# EAGLE design Mainboard_v1 (EAGLE 6.3)
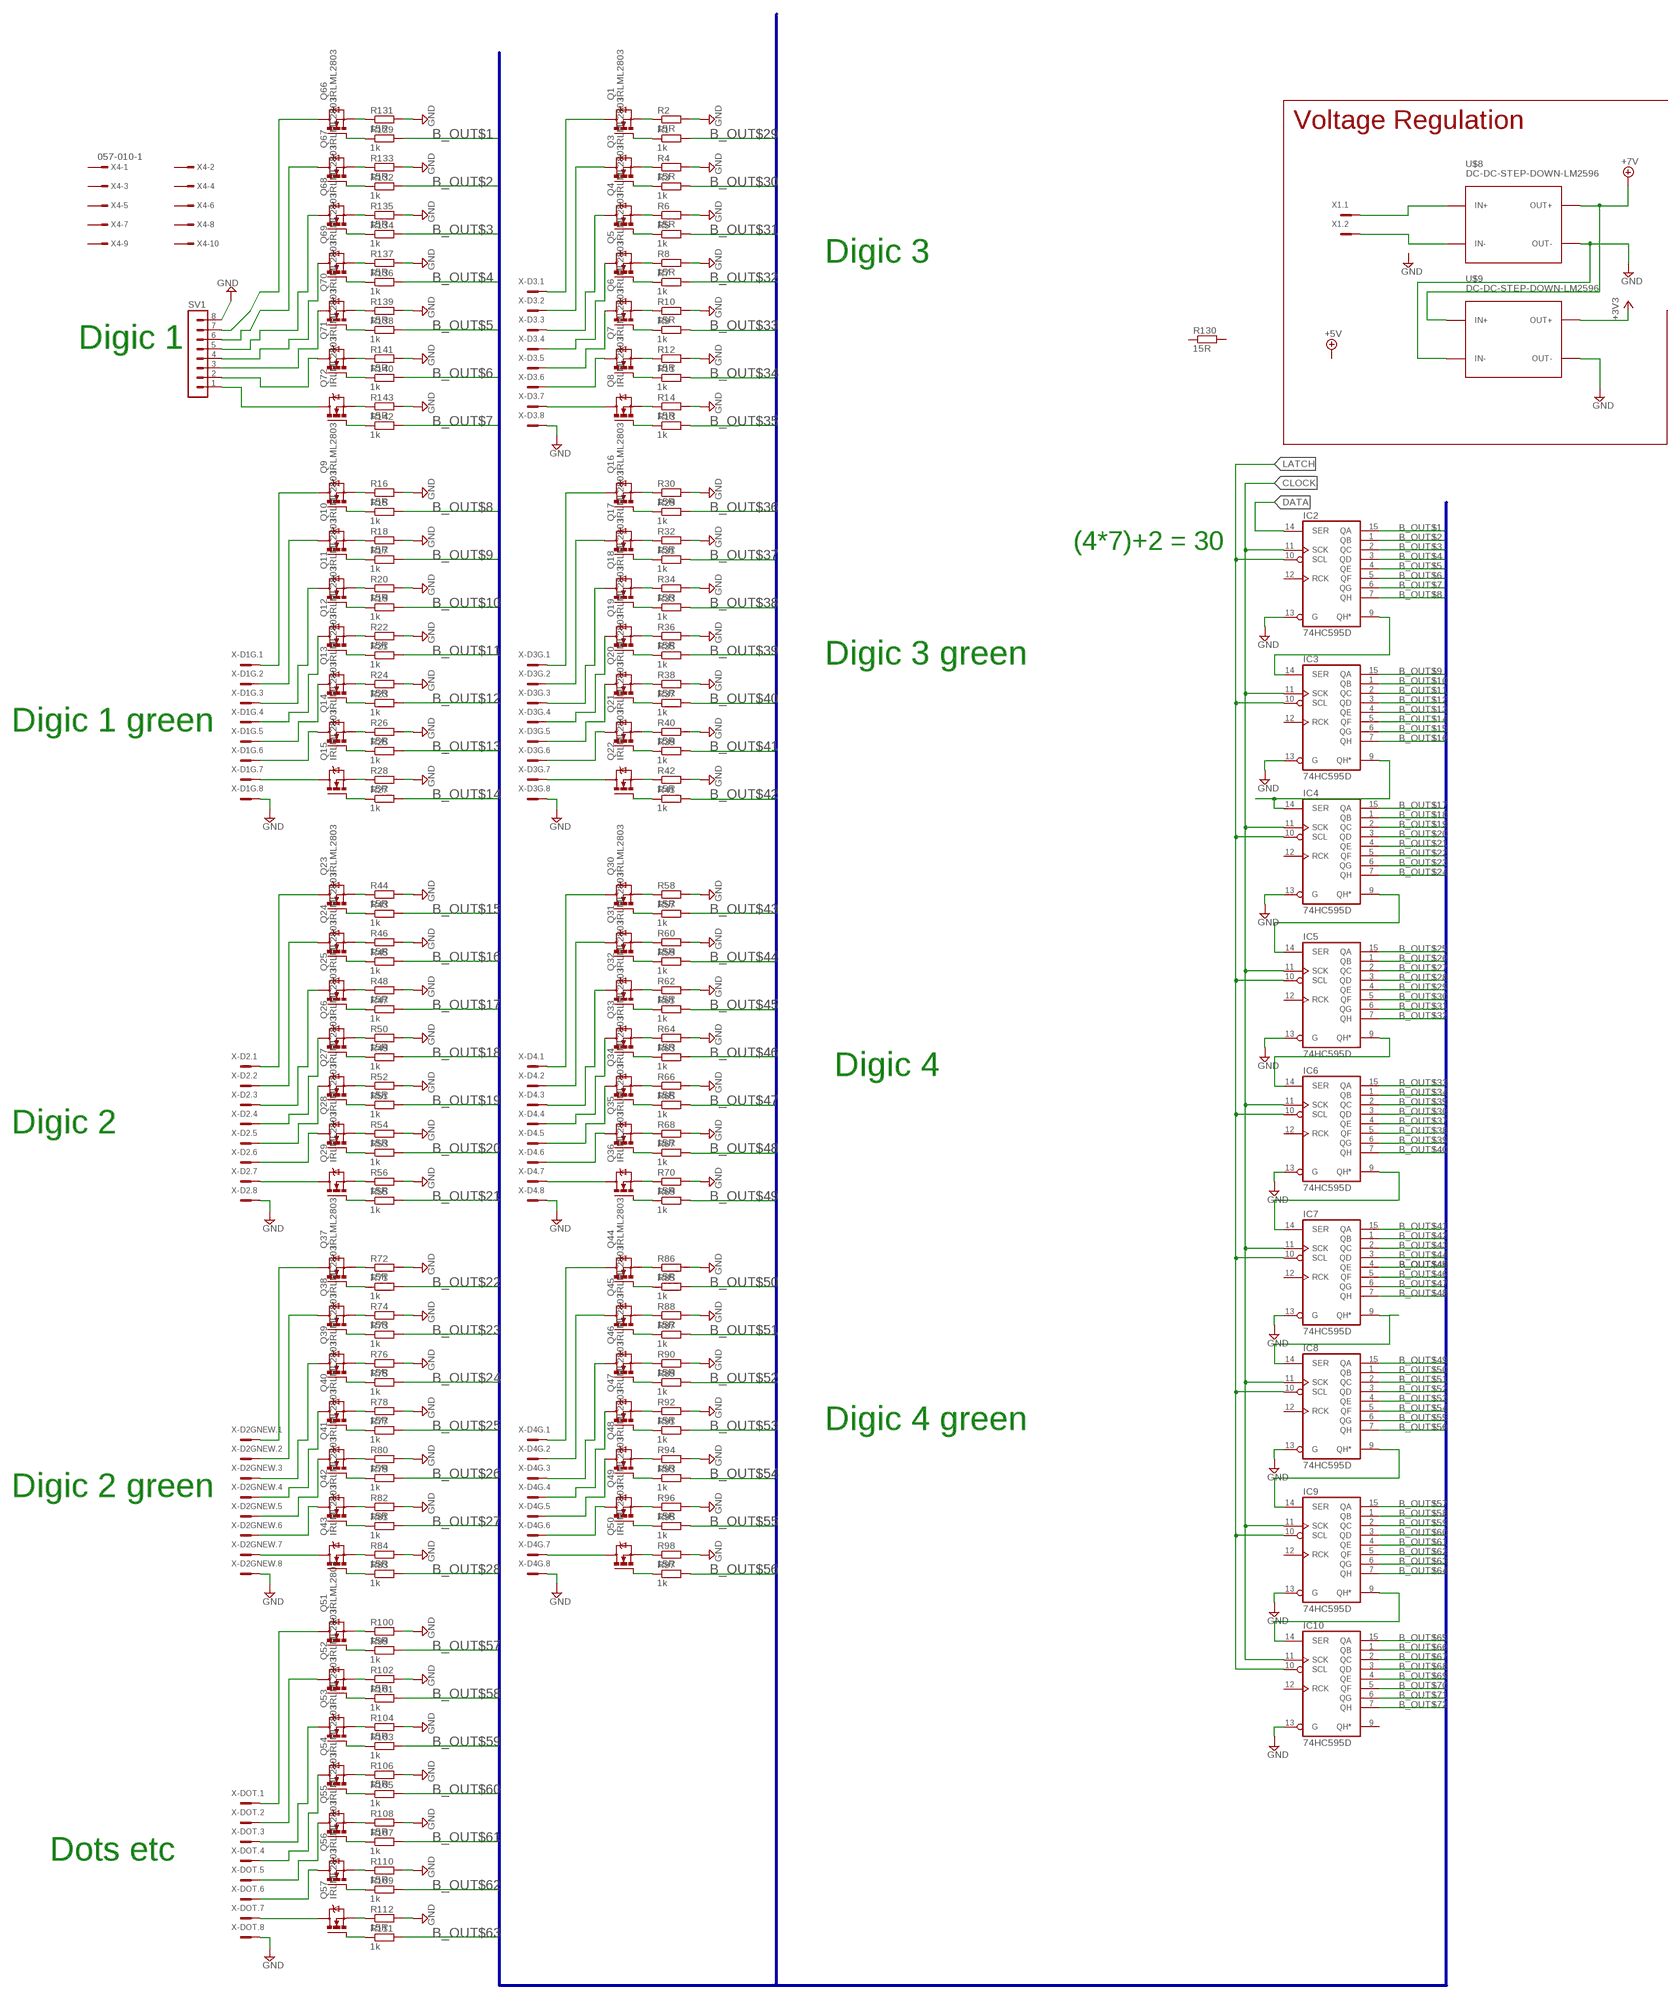
[diagram p0: schematic, sheet 1, part 1 of 2]
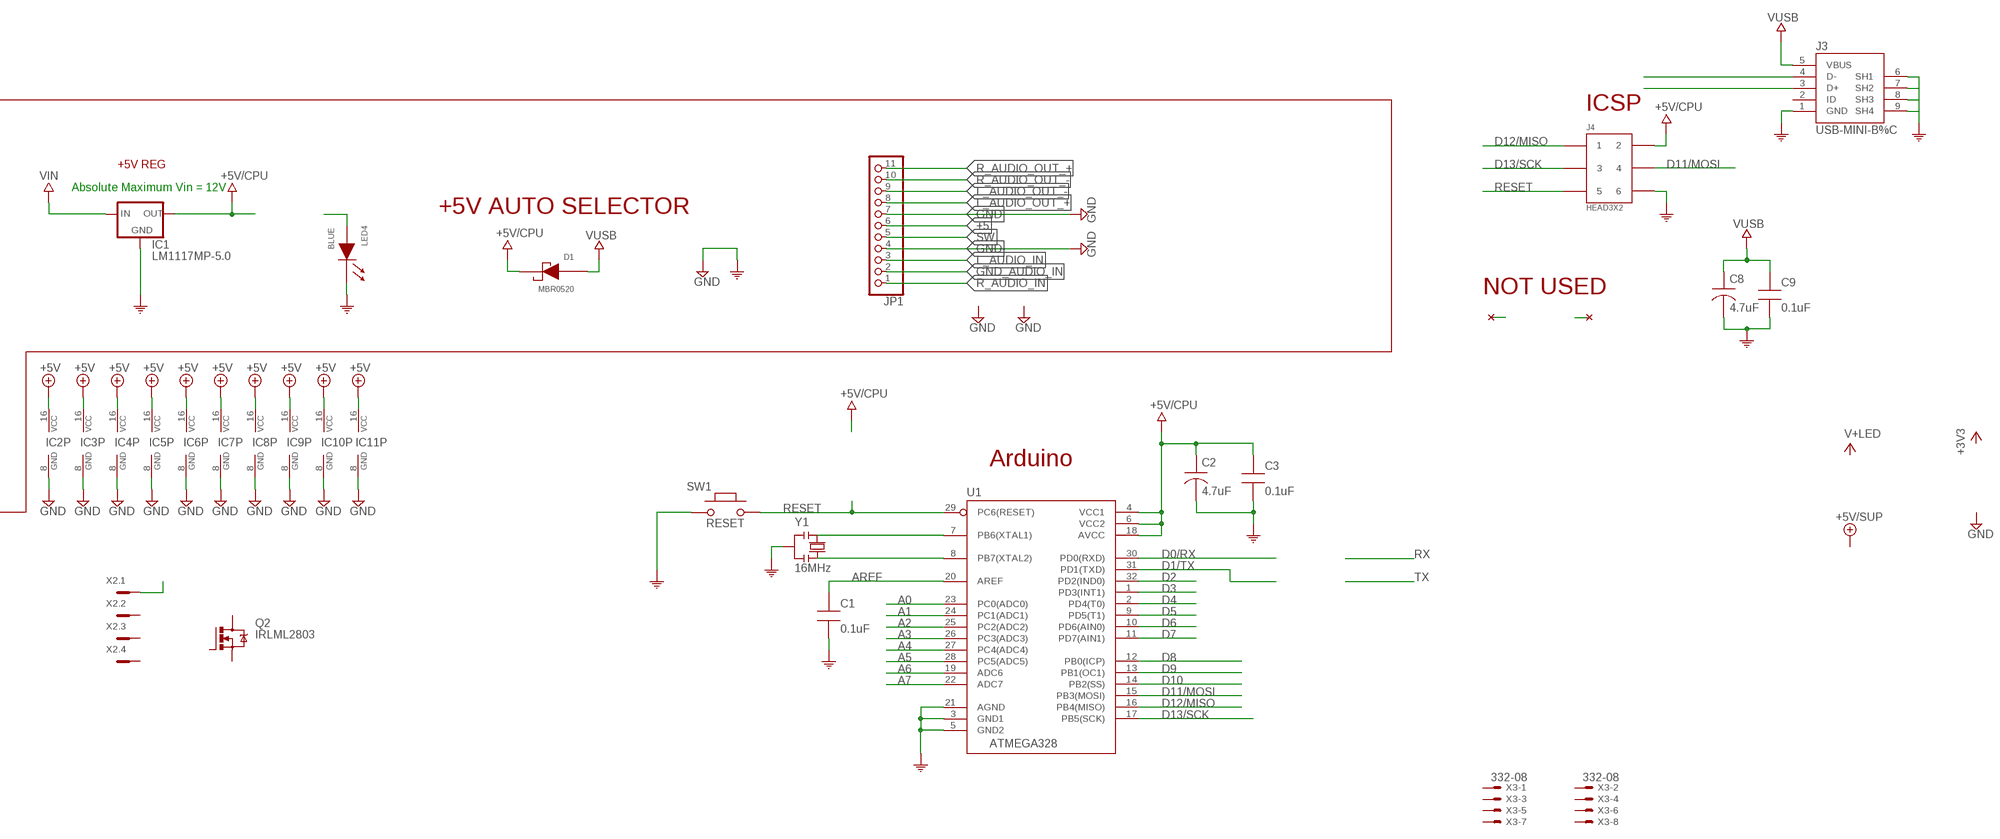
[diagram p1: schematic, sheet 1, part 2 of 2]

## Parts
C1  0.1uF  CAP0805-NP  [CAP0805-NP]
C2  4.7uF  CAP-TANA-P  [TAN-A]
C3  0.1uF  CAP0805-NP  [CAP0805-NP]
C8  4.7uF  CAP-TANA-P  [TAN-A]
C9  0.1uF  CAP0805-NP  [CAP0805-NP]
D1  MBR0520  [SOD-123]
IC1  LM1117MP-5.0  [SOT223]
IC2  74HC595D  [SO16]
IC3  74HC595D  [SO16]
IC4  74HC595D  [SO16]
IC5  74HC595D  [SO16]
IC6  74HC595D  [SO16]
IC7  74HC595D  [SO16]
IC8  74HC595D  [SO16]
IC9  74HC595D  [SO16]
IC10  74HC595D  [SO16]
IC11  74HC595D  [SO16]
J3  USB-MINI-B%C  [USB-MINI-B_2]
J4  HEAD3X2  [HEAD3X2]
JP1  PINHD-1X11_2.00  [1X11M]
LED4  BLUE  LED0805  [LED0805]
Q1  IRLML2803  [MICRO3]
Q2  IRLML2803  [MICRO3]
Q3  IRLML2803  [MICRO3]
Q4  IRLML2803  [MICRO3]
Q5  IRLML2803  [MICRO3]
Q6  IRLML2803  [MICRO3]
Q7  IRLML2803  [MICRO3]
Q8  IRLML2803  [MICRO3]
Q9  IRLML2803  [MICRO3]
Q10  IRLML2803  [MICRO3]
Q11  IRLML2803  [MICRO3]
Q12  IRLML2803  [MICRO3]
Q13  IRLML2803  [MICRO3]
Q14  IRLML2803  [MICRO3]
Q15  IRLML2803  [MICRO3]
Q16  IRLML2803  [MICRO3]
Q17  IRLML2803  [MICRO3]
Q18  IRLML2803  [MICRO3]
Q19  IRLML2803  [MICRO3]
Q20  IRLML2803  [MICRO3]
Q21  IRLML2803  [MICRO3]
Q22  IRLML2803  [MICRO3]
Q23  IRLML2803  [MICRO3]
Q24  IRLML2803  [MICRO3]
Q25  IRLML2803  [MICRO3]
Q26  IRLML2803  [MICRO3]
Q27  IRLML2803  [MICRO3]
Q28  IRLML2803  [MICRO3]
Q29  IRLML2803  [MICRO3]
Q30  IRLML2803  [MICRO3]
Q31  IRLML2803  [MICRO3]
Q32  IRLML2803  [MICRO3]
Q33  IRLML2803  [MICRO3]
Q34  IRLML2803  [MICRO3]
Q35  IRLML2803  [MICRO3]
Q36  IRLML2803  [MICRO3]
Q37  IRLML2803  [MICRO3]
Q38  IRLML2803  [MICRO3]
Q39  IRLML2803  [MICRO3]
Q40  IRLML2803  [MICRO3]
Q41  IRLML2803  [MICRO3]
Q42  IRLML2803  [MICRO3]
Q43  IRLML2803  [MICRO3]
Q44  IRLML2803  [MICRO3]
Q45  IRLML2803  [MICRO3]
Q46  IRLML2803  [MICRO3]
Q47  IRLML2803  [MICRO3]
Q48  IRLML2803  [MICRO3]
Q49  IRLML2803  [MICRO3]
Q50  IRLML2803  [MICRO3]
Q51  IRLML2803  [MICRO3]
Q52  IRLML2803  [MICRO3]
Q53  IRLML2803  [MICRO3]
Q54  IRLML2803  [MICRO3]
Q55  IRLML2803  [MICRO3]
Q56  IRLML2803  [MICRO3]
Q57  IRLML2803  [MICRO3]
Q66  IRLML2803  [MICRO3]
Q67  IRLML2803  [MICRO3]
Q68  IRLML2803  [MICRO3]
Q69  IRLML2803  [MICRO3]
Q70  IRLML2803  [MICRO3]
Q71  IRLML2803  [MICRO3]
Q72  IRLML2803  [MICRO3]
R1  1k  R-EU_M0805  [M0805]
R2  15R  R-EU_M1206  [M1206]
R3  1k  R-EU_M0805  [M0805]
R4  15R  R-EU_M1206  [M1206]
R5  1k  R-EU_M0805  [M0805]
R6  15R  R-EU_M1206  [M1206]
R7  1k  R-EU_M0805  [M0805]
R8  15R  R-EU_M1206  [M1206]
R9  1k  R-EU_M0805  [M0805]
R10  15R  R-EU_M1206  [M1206]
R11  1k  R-EU_M0805  [M0805]
R12  15R  R-EU_M1206  [M1206]
R13  1k  R-EU_M0805  [M0805]
R14  15R  R-EU_M1206  [M1206]
R15  1k  R-EU_M0805  [M0805]
R16  15R  R-EU_M1206  [M1206]
R17  1k  R-EU_M0805  [M0805]
R18  15R  R-EU_M1206  [M1206]
R19  1k  R-EU_M0805  [M0805]
R20  15R  R-EU_M1206  [M1206]
R21  1k  R-EU_M0805  [M0805]
R22  15R  R-EU_M1206  [M1206]
R23  1k  R-EU_M0805  [M0805]
R24  15R  R-EU_M1206  [M1206]
R25  1k  R-EU_M0805  [M0805]
R26  15R  R-EU_M1206  [M1206]
R27  1k  R-EU_M0805  [M0805]
R28  15R  R-EU_M1206  [M1206]
R29  1k  R-EU_M0805  [M0805]
R30  15R  R-EU_M1206  [M1206]
R31  1k  R-EU_M0805  [M0805]
R32  15R  R-EU_M1206  [M1206]
R33  1k  R-EU_M0805  [M0805]
R34  15R  R-EU_M1206  [M1206]
R35  1k  R-EU_M0805  [M0805]
R36  15R  R-EU_M1206  [M1206]
R37  1k  R-EU_M0805  [M0805]
R38  15R  R-EU_M1206  [M1206]
R39  1k  R-EU_M0805  [M0805]
R40  15R  R-EU_M1206  [M1206]
R41  1k  R-EU_M0805  [M0805]
R42  15R  R-EU_M1206  [M1206]
R43  1k  R-EU_M0805  [M0805]
R44  15R  R-EU_M1206  [M1206]
R45  1k  R-EU_M0805  [M0805]
R46  15R  R-EU_M1206  [M1206]
R47  1k  R-EU_M0805  [M0805]
R48  15R  R-EU_M1206  [M1206]
R49  1k  R-EU_M0805  [M0805]
R50  15R  R-EU_M1206  [M1206]
R51  1k  R-EU_M0805  [M0805]
R52  15R  R-EU_M1206  [M1206]
R53  1k  R-EU_M0805  [M0805]
R54  15R  R-EU_M1206  [M1206]
R55  1k  R-EU_M0805  [M0805]
R56  15R  R-EU_M1206  [M1206]
R57  1k  R-EU_M0805  [M0805]
R58  15R  R-EU_M1206  [M1206]
R59  1k  R-EU_M0805  [M0805]
R60  15R  R-EU_M1206  [M1206]
R61  1k  R-EU_M0805  [M0805]
R62  15R  R-EU_M1206  [M1206]
R63  1k  R-EU_M0805  [M0805]
R64  15R  R-EU_M1206  [M1206]
R65  1k  R-EU_M0805  [M0805]
R66  15R  R-EU_M1206  [M1206]
R67  1k  R-EU_M0805  [M0805]
R68  15R  R-EU_M1206  [M1206]
R69  1k  R-EU_M0805  [M0805]
R70  15R  R-EU_M1206  [M1206]
R71  1k  R-EU_M0805  [M0805]
R72  15R  R-EU_M1206  [M1206]
R73  1k  R-EU_M0805  [M0805]
R74  15R  R-EU_M1206  [M1206]
R75  1k  R-EU_M0805  [M0805]
R76  15R  R-EU_M1206  [M1206]
R77  1k  R-EU_M0805  [M0805]
R78  15R  R-EU_M1206  [M1206]
R79  1k  R-EU_M0805  [M0805]
R80  15R  R-EU_M1206  [M1206]
R81  1k  R-EU_M0805  [M0805]
R82  15R  R-EU_M1206  [M1206]
R83  1k  R-EU_M0805  [M0805]
R84  15R  R-EU_M1206  [M1206]
R85  1k  R-EU_M0805  [M0805]
R86  15R  R-EU_M1206  [M1206]
R87  1k  R-EU_M0805  [M0805]
R88  15R  R-EU_M1206  [M1206]
R89  1k  R-EU_M0805  [M0805]
R90  15R  R-EU_M1206  [M1206]
R91  1k  R-EU_M0805  [M0805]
R92  15R  R-EU_M1206  [M1206]
R93  1k  R-EU_M0805  [M0805]
R94  15R  R-EU_M1206  [M1206]
R95  1k  R-EU_M0805  [M0805]
R96  15R  R-EU_M1206  [M1206]
R97  1k  R-EU_M0805  [M0805]
R98  15R  R-EU_M1206  [M1206]
R99  1k  R-EU_M0805  [M0805]
R100  15R  R-EU_M1206  [M1206]
R101  1k  R-EU_M0805  [M0805]
R102  15R  R-EU_M1206  [M1206]
R103  1k  R-EU_M0805  [M0805]
R104  15R  R-EU_M1206  [M1206]
R105  1k  R-EU_M0805  [M0805]
R106  15R  R-EU_M1206  [M1206]
R107  1k  R-EU_M0805  [M0805]
R108  15R  R-EU_M1206  [M1206]
R109  1k  R-EU_M0805  [M0805]
R110  15R  R-EU_M1206  [M1206]
R111  1k  R-EU_M0805  [M0805]
R112  15R  R-EU_M1206  [M1206]
R129  1k  R-EU_M0805  [M0805]
R130  15R  R-EU_M1206  [M1206]
R131  15R  R-EU_M1206  [M1206]
R132  1k  R-EU_M0805  [M0805]
R133  15R  R-EU_M1206  [M1206]
R134  1k  R-EU_M0805  [M0805]
R135  15R  R-EU_M1206  [M1206]
R136  1k  R-EU_M0805  [M0805]
R137  15R  R-EU_M1206  [M1206]
R138  1k  R-EU_M0805  [M0805]
R139  15R  R-EU_M1206  [M1206]
R140  1k  R-EU_M0805  [M0805]
R141  15R  R-EU_M1206  [M1206]
R142  1k  R-EU_M0805  [M0805]
R143  15R  R-EU_M1206  [M1206]
SV1  MA08-1W  [MA08-1W]
SW1  RESET  PB157  [157SW]
U1  ATMEGA328  ATMEGA168-20AU  [QFP032]
U$8  DC-DC-STEP-DOWN-LM2596  [DC-DC-STEP-DOWN-LM2596]
U$9  DC-DC-STEP-DOWN-LM2596  [DC-DC-STEP-DOWN-LM2596]
X1  MCV2-LOCK  [MCV2-LOCK]
X2  MCV4-LOCK  [MCV4-LOCK]
X3  332-08  [332-08]
X4  057-010-1  [057-010-1]
X-D1G  MCV8-LOCK  [MCV8-LOCK]
X-D2  MCV8-LOCK  [MCV8-LOCK]
X-D2GNEW  MCV8-LOCK  [MCV8-LOCK]
X-D3  MCV8-LOCK  [MCV8-LOCK]
X-D3G  MCV8-LOCK  [MCV8-LOCK]
X-D4  MCV8-LOCK  [MCV8-LOCK]
X-D4G  MCV8-LOCK  [MCV8-LOCK]
X-DOT  MCV8-LOCK  [MCV8-LOCK]
Y1  16MHz  RESONATORMU  [RESONATOR]

## Nets
+3V3: U$9.OUT+
+5: JP1.6
+5V: C2.1 C3.1 D1.1(CA) IC1.2(OUT) IC1.4(OUT) IC2.16(VCC) IC3.16(VCC) IC4.16(VCC) IC5.16(VCC) IC6.16(VCC) IC7.16(VCC) IC8.16(VCC) IC9.16(VCC) IC10.16(VCC) IC11.16(VCC) J4.2 U1.4(VCC1) U1.6(VCC2) U1.18(AVCC) ; supply symbol labelled +5V/CPU
+7V: U$8.OUT+ U$9.IN+
A0: U1.23(PC0(ADC0))
A1: U1.24(PC1(ADC1))
A2: U1.25(PC2(ADC2))
A3: U1.26(PC3(ADC3))
A4: U1.27(PC4(ADC4))
A5: U1.28(PC5(ADC5))
A6: U1.19(ADC6)
A7: U1.22(ADC7)
AREF: C1.1 U1.20(AREF)
B_OUT$1: IC2.15(QA) R129.2
B_OUT$2: IC2.1(QB) R132.2
B_OUT$3: IC2.2(QC) R134.2
B_OUT$4: IC2.3(QD) R136.2
B_OUT$5: IC2.4(QE) R138.2
B_OUT$6: IC2.5(QF) R140.2
B_OUT$7: IC2.6(QG) R142.2
B_OUT$8: IC2.7(QH) R15.2
B_OUT$9: IC3.15(QA) R17.2
B_OUT$10: IC3.1(QB) R19.2
B_OUT$11: IC3.2(QC) R21.2
B_OUT$12: IC3.3(QD) R23.2
B_OUT$13: IC3.4(QE) R25.2
B_OUT$14: IC3.5(QF) R27.2
B_OUT$15: IC3.6(QG) R43.2
B_OUT$16: IC3.7(QH) R45.2
B_OUT$17: IC4.15(QA) R47.2
B_OUT$18: IC4.1(QB) R49.2
B_OUT$19: IC4.2(QC) R51.2
B_OUT$20: IC4.3(QD) R53.2
B_OUT$21: IC4.4(QE) R55.2
B_OUT$22: IC4.5(QF) R71.2
B_OUT$23: IC4.6(QG) R73.2
B_OUT$24: IC4.7(QH) R75.2
B_OUT$25: IC5.15(QA) R77.2
B_OUT$26: IC5.1(QB) R79.2
B_OUT$27: IC5.2(QC) R81.2
B_OUT$28: IC5.3(QD) R83.2
B_OUT$29: IC5.4(QE) R1.2
B_OUT$30: IC5.5(QF) R3.2
B_OUT$31: IC5.6(QG) R5.2
B_OUT$32: IC5.7(QH) R7.2
B_OUT$33: IC6.15(QA) R9.2
B_OUT$34: IC6.1(QB) R11.2
B_OUT$35: IC6.2(QC) R13.2
B_OUT$36: IC6.3(QD) R29.2
B_OUT$37: IC6.4(QE) R31.2
B_OUT$38: IC6.5(QF) R33.2
B_OUT$39: IC6.6(QG) R35.2
B_OUT$40: IC6.7(QH) R37.2
B_OUT$41: IC7.15(QA) R39.2
B_OUT$42: IC7.1(QB) R41.2
B_OUT$43: IC7.2(QC) R57.2
B_OUT$44: IC7.3(QD) R59.2
B_OUT$45: IC7.4(QE) R61.2
B_OUT$46: IC7.5(QF) R63.2
B_OUT$47: IC7.6(QG) R65.2
B_OUT$48: IC7.7(QH) R67.2
B_OUT$49: IC8.15(QA) R69.2
B_OUT$50: IC8.1(QB) R85.2
B_OUT$51: IC8.2(QC) R87.2
B_OUT$52: IC8.3(QD) R89.2
B_OUT$53: IC8.4(QE) R91.2
B_OUT$54: IC8.5(QF) R93.2
B_OUT$55: IC8.6(QG) R95.2
B_OUT$56: IC8.7(QH) R97.2
B_OUT$57: IC9.15(QA) R99.2
B_OUT$58: IC9.1(QB) R101.2
B_OUT$59: IC9.2(QC) R103.2
B_OUT$60: IC9.3(QD) R105.2
B_OUT$61: IC9.4(QE) R107.2
B_OUT$62: IC9.5(QF) R109.2
B_OUT$63: IC9.6(QG) R111.2
B_OUT$64: IC9.7(QH)
B_OUT$65: IC10.15(QA)
B_OUT$66: IC10.1(QB)
B_OUT$67: IC10.2(QC)
B_OUT$68: IC10.3(QD)
B_OUT$69: IC10.4(QE)
B_OUT$70: IC10.5(QF)
B_OUT$71: IC10.6(QG)
B_OUT$72: IC10.7(QH)
CLOCK: IC2.11(SCK) IC3.11(SCK) IC4.11(SCK) IC5.11(SCK) IC6.11(SCK) IC7.11(SCK) IC8.11(SCK) IC9.11(SCK) IC10.11(SCK)
COM: C1.2 C2.2 C3.2 C8.2 C9.2 IC1.1(GND) J3.1(GND) J3.6(SH1) J3.7(SH2) J3.8(SH3) J3.9(SH4) J4.6 LED4.1(CA) SW1.1 U1.3(GND1) U1.5(GND2) U1.21(AGND) Y1.2
D0/RX: U1.30(PD0(RXD))
D1/TX: U1.31(PD1(TXD))
D2: U1.32(PD2(IND0))
D3: U1.1(PD3(INT1))
D4: U1.2(PD4(T0))
D5: U1.9(PD5(T1))
D6: U1.10(PD6(AIN0))
D7: U1.11(PD7(AIN1))
D8: U1.12(PB0(ICP))
D9: U1.13(PB1(OC1))
D10: U1.14(PB2(SS))
D11/MOSI: J4.4 U1.15(PB3(MOSI))
D12/MISO: J4.1 U1.16(PB4(MISO))
D13/SCK: J4.3 U1.17(PB5(SCK))
DATA: IC2.14(SER)
GND: IC2.8(GND) IC2.13(G) IC3.8(GND) IC3.13(G) IC4.8(GND) IC4.13(G) IC5.8(GND) IC5.13(G) IC6.8(GND) IC6.13(G) IC7.8(GND) IC7.13(G) IC8.8(GND) IC8.13(G) IC9.8(GND) IC9.13(G) IC10.8(GND) IC10.13(G) IC11.8(GND) JP1.4 JP1.7 R2.2 R4.2 R6.2 R8.2 R10.2 R12.2 R14.2 R16.2 R18.2 R20.2 R22.2 R24.2 R26.2 R28.2 R30.2 R32.2 R34.2 R36.2 R38.2 R40.2 R42.2 R44.2 R46.2 R48.2 R50.2 R52.2 R54.2 R56.2 R58.2 R60.2 R62.2 R64.2 R66.2 R68.2 R70.2 R72.2 R74.2 R76.2 R78.2 R80.2 R82.2 R84.2 R86.2 R88.2 R90.2 R92.2 R94.2 R96.2 R98.2 R100.2 R102.2 R104.2 R106.2 R108.2 R110.2 R112.2 R131.2 R133.2 R135.2 R137.2 R139.2 R141.2 R143.2 SV1.8 U$8.OUT- U$9.IN- U$9.OUT- X-D1G.8 X-D2.8 X-D2GNEW.8 X-D3.8 X-D3G.8 X-D4.8 X-D4G.8 X-DOT.8 ; supply symbol labelled COM
GND_AUDIO_IN: JP1.2
L_AUDIO_IN: JP1.3
L_AUDIO_OUT_+: JP1.8
L_AUDIO_OUT_-: JP1.9
LATCH: IC2.10(SCL) IC3.10(SCL) IC4.10(SCL) IC5.10(SCL) IC6.10(SCL) IC7.10(SCL) IC8.10(SCL) IC9.10(SCL) IC10.10(SCL)
N$1: U1.8(PB7(XTAL2)) Y1.3
N$2: U1.7(PB6(XTAL1)) Y1.1
N$3: LED4.2(AN)
N$4: U$8.IN+ X1.1
N$5: J3.3(D+)
N$6: J3.4(D-)
N$7: U$8.IN- X1.2
N$8: X2.1
N$9: Q1.2(S) R2.1
N$10: Q1.1(G) R1.1
N$11: IC2.9(QH*) IC3.14(SER)
N$12: Q3.2(S) R4.1
N$13: Q3.1(G) R3.1
N$14: IC3.9(QH*) IC4.14(SER)
N$15: Q4.2(S) R6.1
N$16: Q4.1(G) R5.1
N$17: IC5.9(QH*) IC6.14(SER)
N$18: Q5.2(S) R8.1
N$19: Q5.1(G) R7.1
N$20: IC4.9(QH*) IC5.14(SER)
N$21: Q6.2(S) R10.1
N$22: Q6.1(G) R9.1
N$23: IC6.9(QH*) IC7.14(SER)
N$26: Q7.2(S) R12.1
N$27: Q7.1(G) R11.1
N$28: IC7.9(QH*) IC8.14(SER)
N$29: Q8.2(S) R14.1
N$30: Q8.1(G) R13.1
N$31: IC8.9(QH*) IC9.14(SER)
N$32: Q8.3(D) X-D3.7
N$33: Q7.3(D) X-D3.6
N$34: Q6.3(D) X-D3.5
N$35: Q5.3(D) X-D3.4
N$37: Q3.3(D) X-D3.2
N$38: Q1.3(D) X-D3.1
N$39: Q9.2(S) R16.1
N$40: Q9.1(G) R15.1
N$41: IC9.9(QH*) IC10.14(SER)
N$42: Q10.2(S) R18.1
N$43: Q10.1(G) R17.1
N$45: Q11.2(S) R20.1
N$46: Q11.1(G) R19.1
N$48: Q12.2(S) R22.1
N$49: Q12.1(G) R21.1
N$51: Q13.2(S) R24.1
N$52: Q13.1(G) R23.1
N$54: Q14.2(S) R26.1
N$55: Q14.1(G) R25.1
N$57: Q15.2(S) R28.1
N$58: Q15.1(G) R27.1
N$60: Q15.3(D) X-D1G.7
N$61: Q14.3(D) X-D1G.6
N$62: Q13.3(D) X-D1G.5
N$63: Q12.3(D) X-D1G.4
N$64: Q11.3(D) X-D1G.3
N$65: Q10.3(D) X-D1G.2
N$66: Q9.3(D) X-D1G.1
N$67: Q16.2(S) R30.1
N$68: Q16.1(G) R29.1
N$70: Q17.2(S) R32.1
N$71: Q17.1(G) R31.1
N$73: Q18.2(S) R34.1
N$74: Q18.1(G) R33.1
N$76: Q19.2(S) R36.1
N$77: Q19.1(G) R35.1
N$79: Q20.2(S) R38.1
N$80: Q20.1(G) R37.1
N$82: Q21.2(S) R40.1
N$83: Q21.1(G) R39.1
N$85: Q22.2(S) R42.1
N$86: Q22.1(G) R41.1
N$88: Q22.3(D) X-D3G.7
N$89: Q21.3(D) X-D3G.6
N$90: Q20.3(D) X-D3G.5
N$91: Q19.3(D) X-D3G.4
N$92: Q18.3(D) X-D3G.3
N$93: Q17.3(D) X-D3G.2
N$94: Q16.3(D) X-D3G.1
N$95: Q23.2(S) R44.1
N$96: Q23.1(G) R43.1
N$98: Q24.2(S) R46.1
N$99: Q24.1(G) R45.1
N$101: Q25.2(S) R48.1
N$102: Q25.1(G) R47.1
N$104: Q26.2(S) R50.1
N$105: Q26.1(G) R49.1
N$107: Q27.2(S) R52.1
N$108: Q27.1(G) R51.1
N$110: Q28.2(S) R54.1
N$111: Q28.1(G) R53.1
N$113: Q29.2(S) R56.1
N$114: Q29.1(G) R55.1
N$116: Q29.3(D) X-D2.7
N$117: Q28.3(D) X-D2.6
N$118: Q27.3(D) X-D2.5
N$119: Q26.3(D) X-D2.4
N$120: Q25.3(D) X-D2.3
N$121: Q24.3(D) X-D2.2
N$122: Q23.3(D) X-D2.1
N$123: Q30.2(S) R58.1
N$124: Q30.1(G) R57.1
N$126: Q31.2(S) R60.1
N$127: Q31.1(G) R59.1
N$129: Q32.2(S) R62.1
N$130: Q32.1(G) R61.1
N$132: Q33.2(S) R64.1
N$133: Q33.1(G) R63.1
N$135: Q34.2(S) R66.1
N$136: Q34.1(G) R65.1
N$138: Q35.2(S) R68.1
N$139: Q35.1(G) R67.1
N$141: Q36.2(S) R70.1
N$142: Q36.1(G) R69.1
N$144: Q36.3(D) X-D4.7
N$145: Q35.3(D) X-D4.6
N$146: Q34.3(D) X-D4.5
N$147: Q33.3(D) X-D4.4
N$148: Q32.3(D) X-D4.3
N$149: Q31.3(D) X-D4.2
N$150: Q30.3(D) X-D4.1
N$151: Q37.2(S) R72.1
N$152: Q37.1(G) R71.1
N$154: Q38.2(S) R74.1
N$155: Q38.1(G) R73.1
N$157: Q39.2(S) R76.1
N$158: Q39.1(G) R75.1
N$160: Q40.2(S) R78.1
N$161: Q40.1(G) R77.1
N$163: Q41.2(S) R80.1
N$164: Q41.1(G) R79.1
N$166: Q42.2(S) R82.1
N$167: Q42.1(G) R81.1
N$169: Q43.2(S) R84.1
N$170: Q43.1(G) R83.1
N$172: Q43.3(D) X-D2GNEW.7
N$173: Q42.3(D) X-D2GNEW.6
N$174: Q41.3(D) X-D2GNEW.5
N$175: Q40.3(D) X-D2GNEW.4
N$176: Q39.3(D) X-D2GNEW.3
N$177: Q38.3(D) X-D2GNEW.2
N$178: Q37.3(D) X-D2GNEW.1
N$179: Q44.2(S) R86.1
N$180: Q44.1(G) R85.1
N$182: Q45.2(S) R88.1
N$183: Q45.1(G) R87.1
N$185: Q46.2(S) R90.1
N$186: Q46.1(G) R89.1
N$188: Q47.2(S) R92.1
N$189: Q47.1(G) R91.1
N$191: Q48.2(S) R94.1
N$192: Q48.1(G) R93.1
N$194: Q49.2(S) R96.1
N$195: Q49.1(G) R95.1
N$197: Q50.2(S) R98.1
N$198: Q50.1(G) R97.1
N$200: Q50.3(D) X-D4G.7
N$201: Q49.3(D) X-D4G.6
N$202: Q48.3(D) X-D4G.5
N$203: Q68.2(S) R135.1
N$204: Q66.2(S) R131.1
N$205: Q66.1(G) R129.1
N$207: Q68.1(G) R134.1
N$208: Q67.2(S) R133.1
N$209: Q67.1(G) R132.1
N$212: Q69.2(S) R137.1
N$213: Q69.1(G) R136.1
N$215: Q70.2(S) R139.1
N$216: Q70.1(G) R138.1
N$218: Q71.2(S) R141.1
N$219: Q71.1(G) R140.1
N$221: Q72.2(S) R143.1
N$222: Q72.1(G) R142.1
N$224: Q72.3(D) SV1.1
N$225: Q71.3(D) SV1.2
N$226: Q70.3(D) SV1.3
N$227: Q69.3(D) SV1.4
N$228: Q68.3(D) SV1.5
N$229: Q67.3(D) SV1.6
N$230: Q66.3(D) SV1.7
N$231: Q47.3(D) X-D4G.4
N$232: Q46.3(D) X-D4G.3
N$233: Q45.3(D) X-D4G.2
N$234: Q44.3(D) X-D4G.1
N$235: Q51.2(S) R100.1
N$236: Q51.1(G) R99.1
N$238: Q52.2(S) R102.1
N$239: Q52.1(G) R101.1
N$241: Q53.2(S) R104.1
N$242: Q53.1(G) R103.1
N$244: Q54.2(S) R106.1
N$245: Q54.1(G) R105.1
N$247: Q55.2(S) R108.1
N$248: Q55.1(G) R107.1
N$250: Q56.2(S) R110.1
N$251: Q56.1(G) R109.1
N$253: Q57.2(S) R112.1
N$254: Q57.1(G) R111.1
N$256: Q57.3(D) X-DOT.7
N$257: Q56.3(D) X-DOT.6
N$258: Q55.3(D) X-DOT.5
N$259: Q54.3(D) X-DOT.4
N$260: Q53.3(D) X-DOT.3
N$261: Q52.3(D) X-DOT.2
N$262: Q51.3(D) X-DOT.1
R_AUDIO_IN: JP1.1
R_AUDIO_OUT_+: JP1.11
R_AUDIO_OUT_-: JP1.10
RESET: J4.5 SW1.2 U1.29(PC6(RESET))
SW: JP1.5
VIN: IC1.3(IN)
VUSB: C8.1 C9.1 D1.2(AN) J3.5(VBUS)
X-D1G: Q4.3(D) X-D3.3
Unconnected: IC2.12(RCK) IC3.12(RCK) IC4.12(RCK) IC5.12(RCK) IC6.12(RCK) IC7.12(RCK) IC8.12(RCK) IC9.12(RCK) IC10.9(QH*) IC10.12(RCK) IC11.1(QB) IC11.2(QC) IC11.3(QD) IC11.4(QE) IC11.5(QF) IC11.6(QG) IC11.7(QH) IC11.9(QH*) IC11.10(SCL) IC11.11(SCK) IC11.12(RCK) IC11.13(G) IC11.14(SER) IC11.15(QA) J3.2(ID) Q2.1(G) Q2.2(S) Q2.3(D) R130.1 R130.2 X2.2 X2.3 X2.4 X3.1 X3.2 X3.3 X3.4 X3.5 X3.6 X3.7 X3.8 X4.1 X4.2 X4.3 X4.4 X4.5 X4.6 X4.7 X4.8 X4.9 X4.10

## Buses
B_OUT$[1..72]

## Notes on the sheet
- ICSP
- Voltage Regulation
- +5V REG
- Absolute Maximum Vin = 12V
- +5V AUTO SELECTOR
- Digic 3 | NOT USED
- Digic 1
- Arduino
- (4*7)+2 = 30
- Digic 3 green
- Digic 1 green
- Digic 4
- Digic 2
- Digic 4 green
- Digic 2 green
- Dots etc

## Library data of the parts
C1 C3 C9 = MySMD:CAP0805-NP
C2 C8 = MySMD:CAP-TANA-P
D1 = MySMD:MBR0520
IC1 = lm1117_10:LM1117?-*: 800mA Low-Dropout Linear Regulator Source: http://www.ti.com/lit/ds/symlink/lm1117-n.pdf; MF: Texas Instruments; MPN: LM1117MP-5.0; OC_FARNELL: 9778209; OC_NEWARK: 28X3417
IC2-IC11 = 74xx-eu:74*595: 8-bit SHIFT REGISTER, output latch
J3 = MyCON2:USB-MINI-B
J4 = MyCON2:HEAD3X2
JP1 = pinhead-1:PINHD-1X11: PIN HEADER
LED4 = MySMD:LED0805
Q1-Q57 Q66-Q72 = irlml2803:IRLML2803: IRLML 2803 NFET HEXFET POWERMOSFET N-LogicLevel VDSS = 30V RDS(ON) = 0,25R SOT 23 1,2A max @ 25° Height = 1,1mm
R1-R112 R129-R143 = rcl:R-EU_: RESISTOR, European symbol
SV1 = con-lstb:MA08-1W: PIN HEADER; OC_FARNELL: unknown; OC_NEWARK: unknown
SW1 = MySMD:PB157
U1 = MySMD:ATMEGA168-20AU
U$8 U$9 = diy_modules:DC-DC-STEP-DOWN-LM2596: DC/DC Step-Down Regulator based on LM2596-ADJ chip
X1 = con-phoenix_3.81_mcv:MCV2-LOCK: Phoenix Contact: MCV 1.5/2-GF-3.81
X2 = con-phoenix_3.81_mcv:MCV4-LOCK: Phoenix Contact: MCV 1.5/4-GF-3.81
X3 = con-garry:332-08: 8 Pin - 2mm Dual Row Source: www.mpe-connector.de / garry_shortform_2012.pdf
X4 = con-panduit:057-010-: CONNECTOR 10-pin series 057 contact pc board low profile headers; OC_FARNELL: unknown; OC_NEWARK: unknown
X-D1G X-D2 X-D2GNEW X-D3 X-D3G X-D4 X-D4G X-DOT = con-phoenix_3.81_mcv:MCV8-LOCK: Phoenix Contact: MCV 1.5/8-GF-3.81
Y1 = MySMD2:RESONATOR

## Board
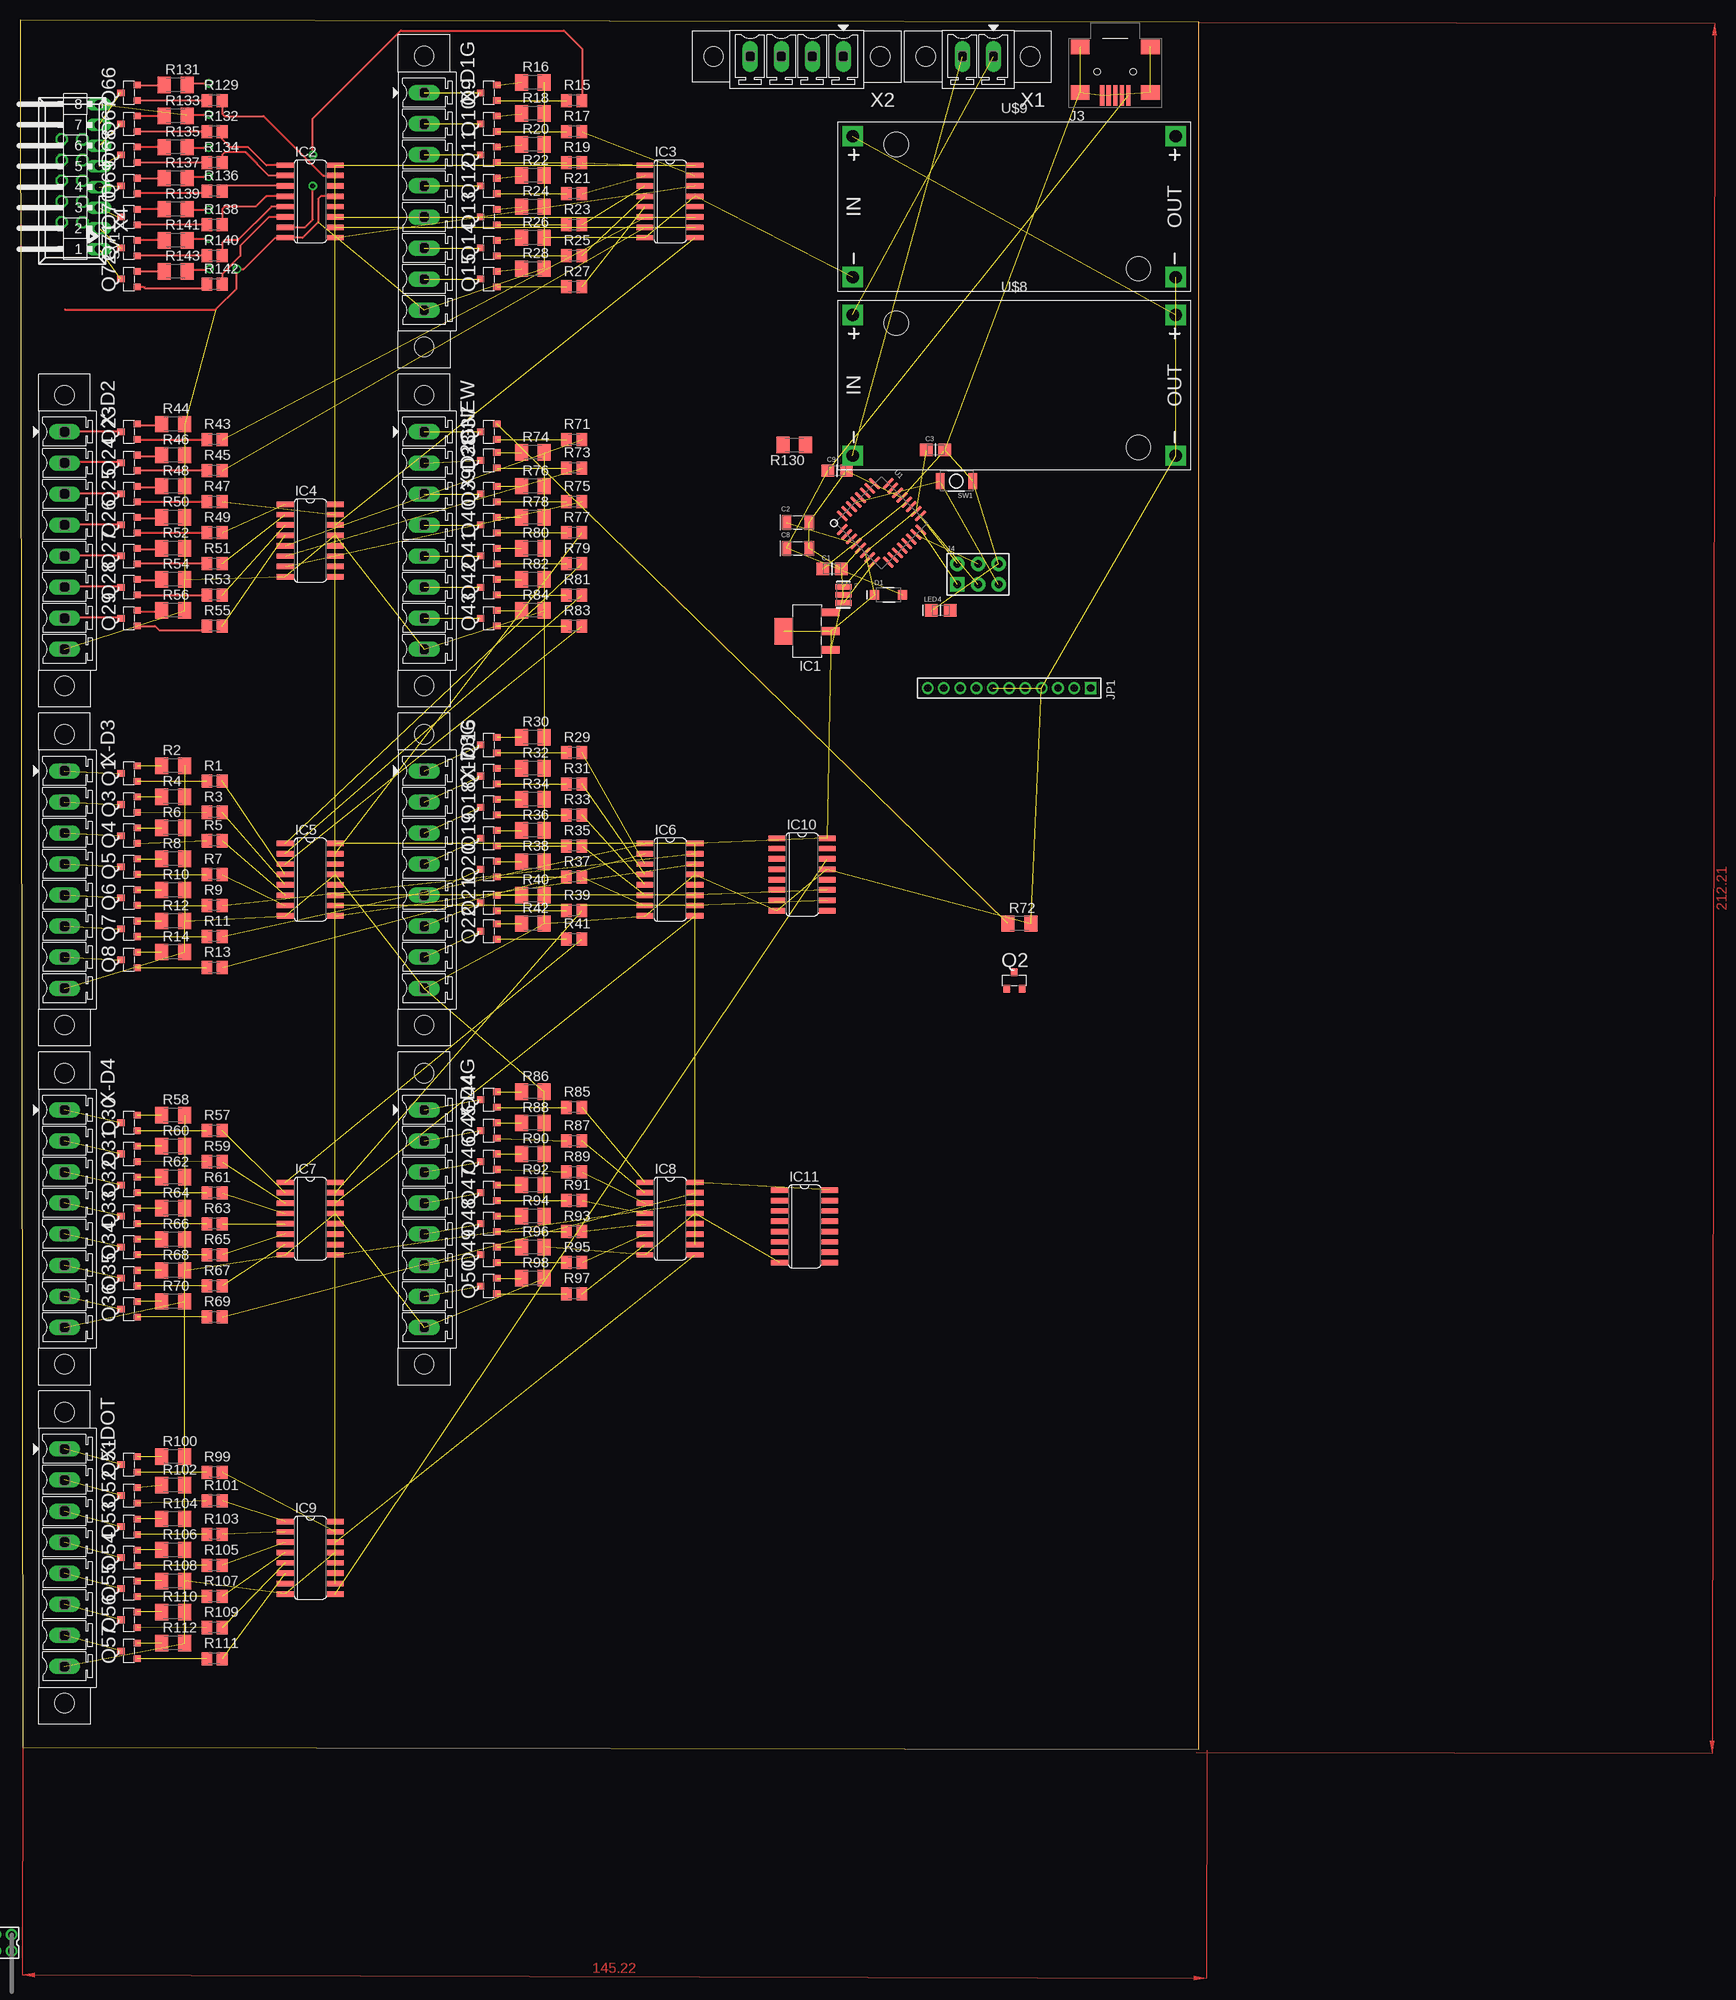
[diagram p2: board, top side]
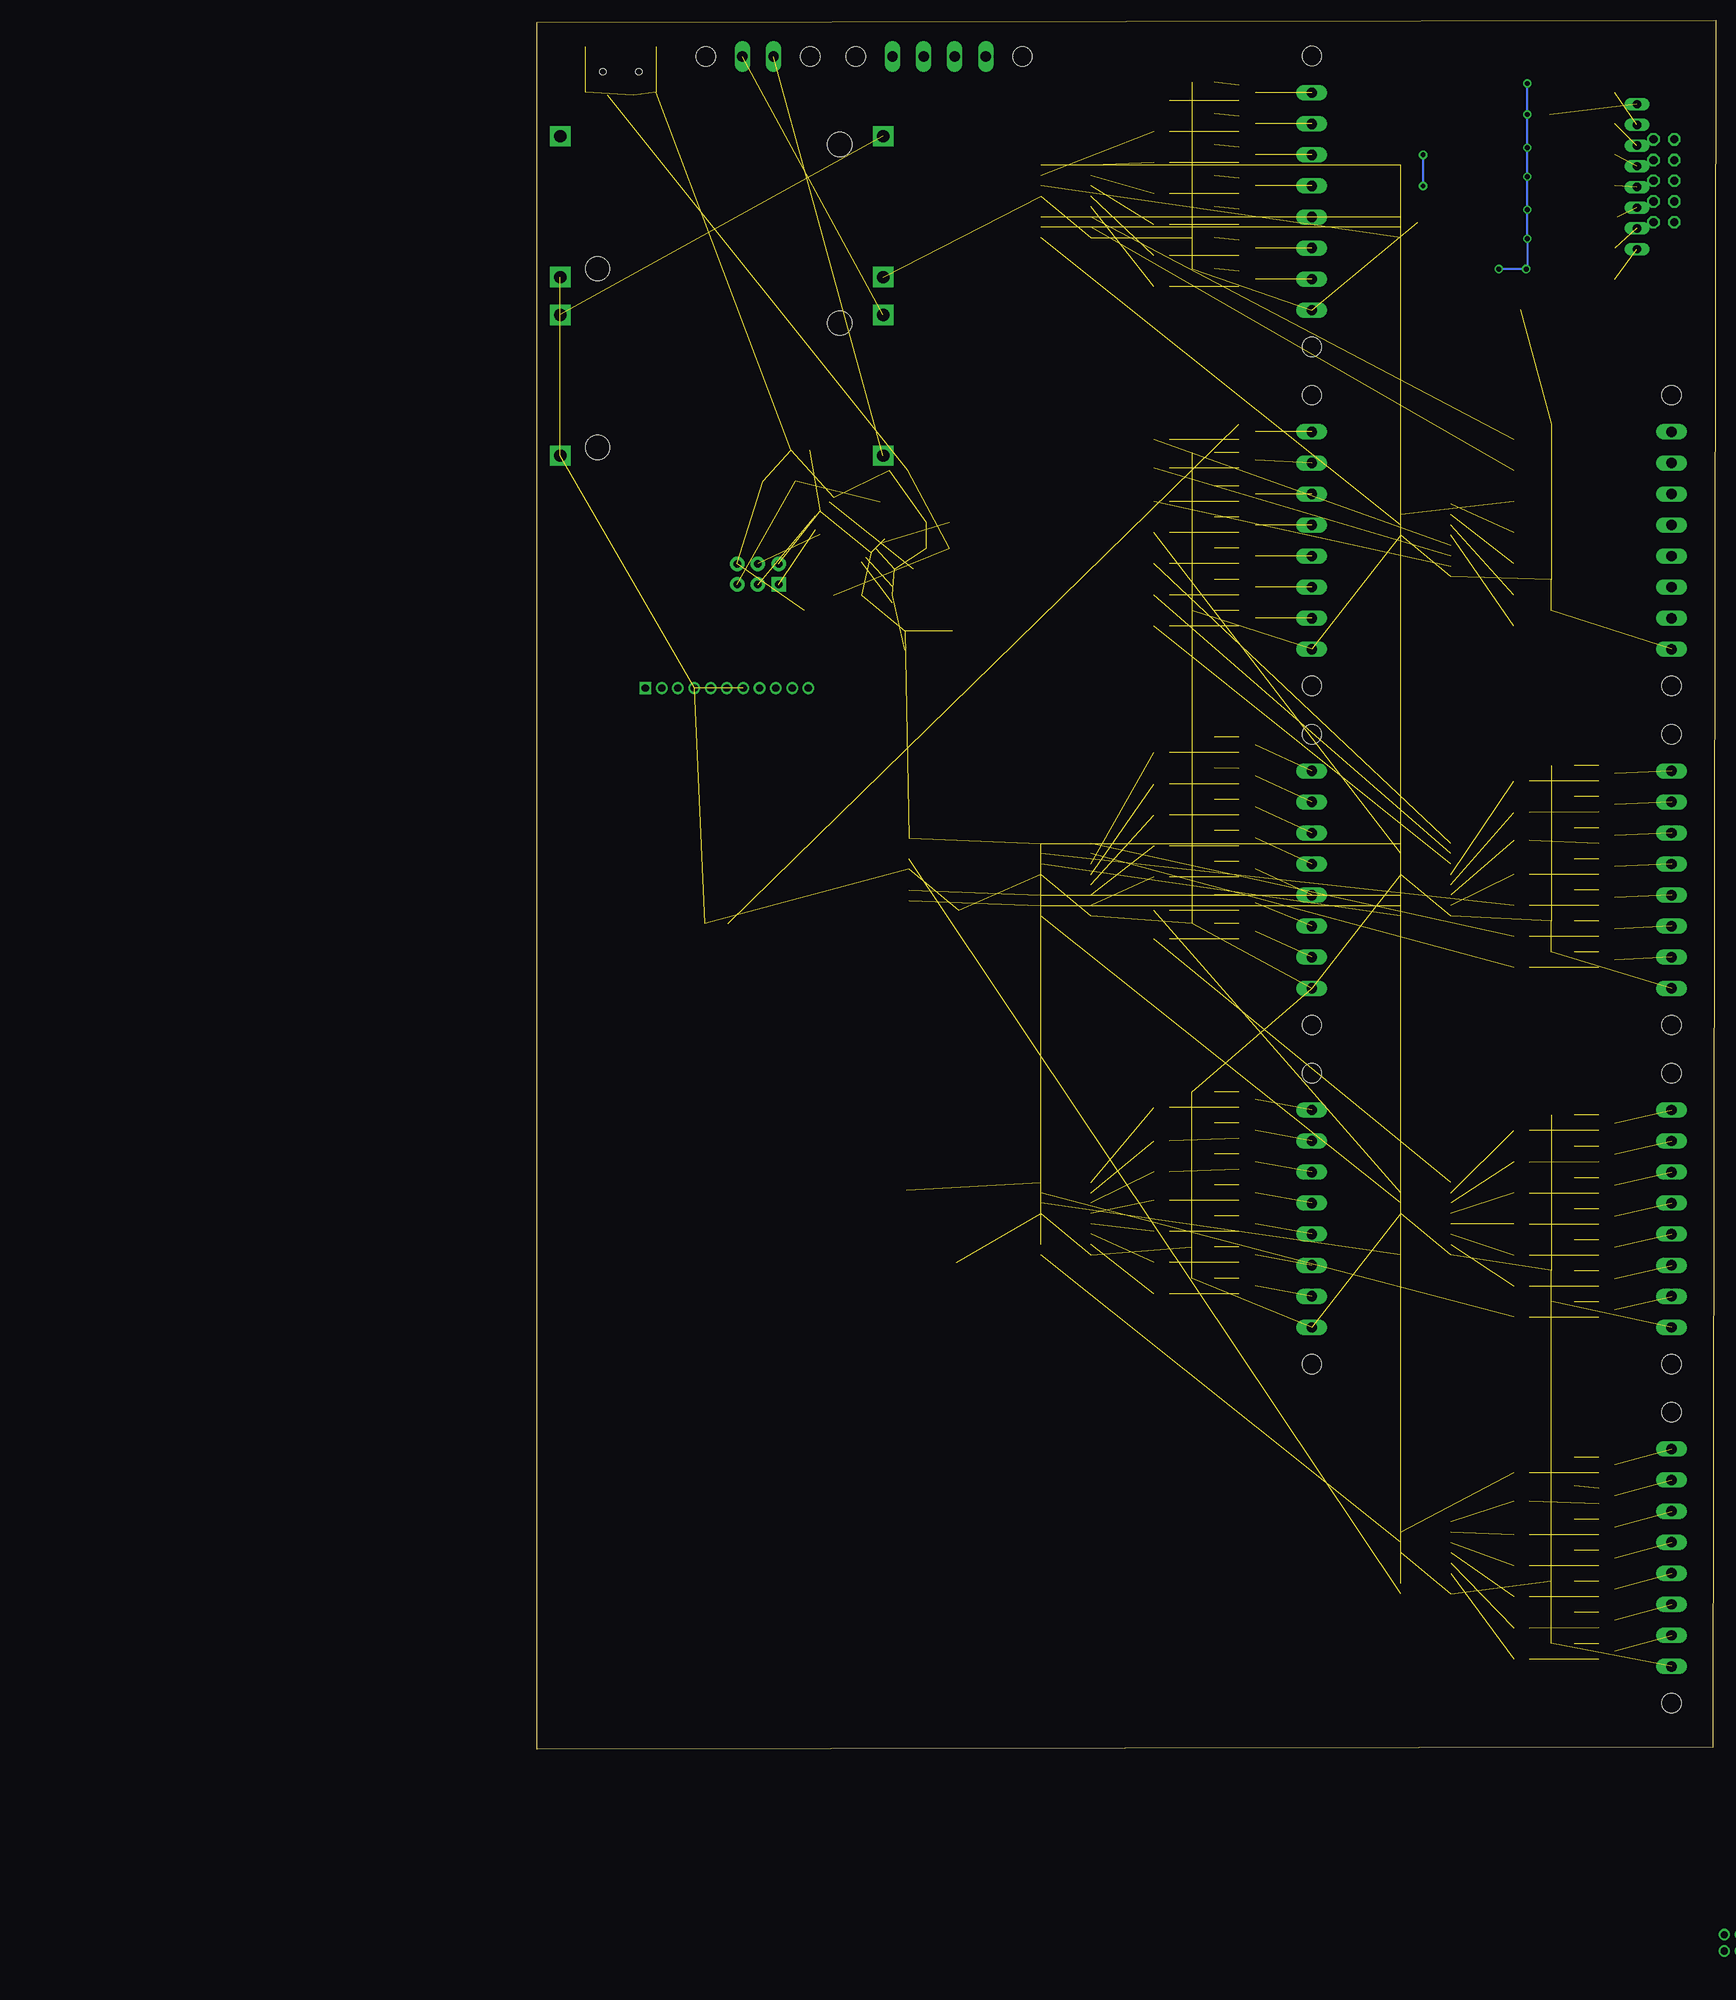
[diagram p3: board, bottom side, seen from below]

Size 144.58 x 212.08 mm. Coordinates in mm from the lower left corner, seen from the top.
Outline: 0.32,0.25 144.58,0 144.58,211.83 0,212.08 0.32,0.25
Copper layers (1*16): Top 0.035mm / dielectric 1.5mm / Bottom 0.035mm
Design rules "default": minimum track width 10mil, minimum drill 24mil, track to track 8mil, track to pad 8mil, pad to pad 8mil, via to via 8mil, smd to smd 8mil, copper to edge 40mil, drill to drill 8mil, minimum pad ring 10mil, minimum via ring 8mil, stop-mask expansion 4mil, vias tented up to drill 0mil, thermal gap 10mil

### Footprints (pad centres in the part's own frame; a part is rotated, then mirrored left to right if it is on the bottom)
CAP0805-NP = smd 1.524 x 1.524: 1 0,0; 2 2.286,0
TAN-A = smd 1.118 x 1.778: 1 0,0; 2 2.794,0
SOD-123 = smd 1.143 x 1.143: 1 0,0; 2 3.429,0
SOT223 = smd 0.95 x 2.15: 1 -2.3,-2.9; 2 0,-2.9; 3 2.3,-2.9 | smd 3.25 x 2.15: 4 0,2.9
SO16 = smd 0.66 x 2.032: 1 -4.445,-3.073; 2 -3.175,-3.073; 3 -1.905,-3.073; 4 -0.635,-3.073; 5 0.635,-3.073; 6 1.905,-3.073; 7 3.175,-3.073; 8 4.445,-3.073; 9 4.445,3.073; 10 3.175,3.073; 11 1.905,3.073; 12 0.635,3.073; 13 -0.635,3.073; 14 -1.905,3.073; 15 -3.175,3.073; 16 -4.445,3.073
USB-MINI-B_2 = smd 0.508 x 2.54: 1 0,0; 2 0.8,0; 3 1.6,0; 4 2.4,0; 5 3.2,0 | smd 2.286 x 1.778: 6 -2.717,5.948; 7 -2.717,0.36; 8 5.918,0.36; 9 5.918,5.948 | hole 0.813: -0.6,2.9; 3.8,2.9
HEAD3X2 = drill 0.914 pad 1.778 square: 1 0,0 | drill 0.914 pad 1.778: 2 0,2.54; 3 2.54,0; 4 2.54,2.54; 5 5.08,0; 6 5.08,2.54
1X11M = drill 0.914 square: 1 -10,0 | drill 0.914: 2 -8,0; 3 -6,0; 4 -4,0; 5 -2,0; 6 0,0; 7 2,0; 8 4,0; 9 6,0; 10 8,0; 11 10,0
LED0805 = smd 1.524 x 1.524: 1 0,0; 2 2.286,0
MICRO3 = smd 0.8 x 0.9: 1 -0.95,-1; 2 0.95,-1; 3 0,1
M0805 = smd 1.3 x 1.6: 1 -0.95,0; 2 0.95,0
M1206 = smd 1.6 x 2: 1 -1.4,0; 2 1.4,0
MA08-1W = drill 1.016 long: 1 -8.89,0; 2 -6.35,0; 3 -3.81,0; 4 -1.27,0; 5 1.27,0; 6 3.81,0; 7 6.35,0; 8 8.89,0
157SW = smd 1.016 x 1.981: 1 0,0; 2 4,0
QFP032 = smd 0.432 x 1.778: 1 0,0; 2 0.8,0; 3 1.599,0; 4 2.399,0; 5 3.199,0; 6 3.998,0; 7 4.798,0; 8 5.598,0; 17 5.588,8.001; 18 4.798,7.997; 19 3.998,7.997; 20 3.199,7.997; 21 2.399,7.997; 22 1.599,7.997; 23 0.799,7.997; 24 0,7.997 | smd 1.778 x 0.432: 9 6.807,1.194; 10 6.807,2.007; 11 6.807,2.794; 12 6.807,3.607; 13 6.807,4.394; 14 6.807,5.182; 15 6.807,5.994; 16 6.816,6.803; 25 -1.194,6.807; 26 -1.194,5.994; 27 -1.194,5.182; 28 -1.194,4.394; 29 -1.194,3.607; 30 -1.194,2.794; 31 -1.194,2.007; 32 -1.194,1.194
DC-DC-STEP-DOWN-LM2596 = drill 1.5 pad 2.5 square: IN+ -19.812,8.636; IN- -19.812,-8.636; OUT+ 19.812,8.636; OUT- 19.812,-8.636 | hole 3: -14.478,7.62; 15.24,-7.62
MCV2-LOCK = drill 1.27 pad 1.905 long: 1 -1.905,0; 2 1.905,0 | hole 2.4: -6.405,0; 6.405,0
MCV4-LOCK = drill 1.27 pad 1.905 long: 1 -5.715,0; 2 -1.905,0; 3 1.905,0; 4 5.715,0 | hole 2.4: -10.215,0; 10.215,0
332-08 = drill 0.9 pad 1.27: 1 -3,-1; 2 -3,1; 3 -1,-1; 4 -1,1; 5 1,-1; 6 1,1; 7 3,-1; 8 3,1
057-010-1 = drill 1 octagon: 1 -5.08,-1.27; 2 -5.08,1.27; 3 -2.54,-1.27; 4 -2.54,1.27; 5 0,-1.27; 6 0,1.27; 7 2.54,-1.27; 8 2.54,1.27; 9 5.08,-1.27; 10 5.08,1.27
MCV8-LOCK = drill 1.27 pad 1.905 long: 1 -13.335,0; 2 -9.525,0; 3 -5.715,0; 4 -1.905,0; 5 1.905,0; 6 5.715,0; 7 9.525,0; 8 13.335,0 | hole 2.4: -17.835,0; 17.835,0
RESONATOR = smd 0.7 x 2: 1 -1,0; 2 0,0; 3 1,0

### Placement (x,y rotation side)
C1  98.42,144.78 0 top
C2  93.98,150.5 0 top
C3  111.12,159.38 0 top
C8  93.98,147.32 0 top
C9  99.06,156.84 0 top
D1  104.78,141.61 0 top
IC1  96.52,137.16 90 top
IC2  35.56,189.87 270 top
IC3  79.69,189.87 270 top
IC4  35.56,148.27 270 top
IC5  35.56,106.68 270 top
IC6  79.69,106.68 270 top
IC7  35.56,65.09 270 top
IC8  79.69,65.09 270 top
IC9  35.56,23.5 270 top
IC10  95.89,107.31 270 top
IC11  96.2,64.14 270 top
J3  132.72,202.88 0 top
J4  114.94,142.88 0 top
JP1  121.28,130.18 180 top
LED4  111.76,139.7 0 top
Q1  13.34,119.7 90 top
Q2  121.92,94.3 0 top
Q3  13.34,115.89 90 top
Q4  13.34,112.08 90 top
Q5  13.34,108.27 90 top
Q6  13.34,104.46 90 top
Q7  13.34,100.65 90 top
Q8  13.34,96.84 90 top
Q9  57.47,203.2 90 top
Q10  57.47,199.39 90 top
Q11  57.47,195.58 90 top
Q12  57.47,191.77 90 top
Q13  57.47,187.96 90 top
Q14  57.47,184.15 90 top
Q15  57.47,180.34 90 top
Q16  57.47,123.19 90 top
Q17  57.47,119.38 90 top
Q18  57.47,115.57 90 top
Q19  57.47,111.76 90 top
Q20  57.47,107.95 90 top
Q21  57.47,103.82 90 top
Q22  57.47,100.33 90 top
Q23  13.34,161.61 90 top
Q24  13.34,157.8 90 top
Q25  13.34,153.99 90 top
Q26  13.34,150.18 90 top
Q27  13.34,146.37 90 top
Q28  13.34,142.56 90 top
Q29  13.34,138.75 90 top
Q30  13.34,76.84 90 top
Q31  13.34,73.03 90 top
Q32  13.34,69.22 90 top
Q33  13.34,65.41 90 top
Q34  13.34,61.59 90 top
Q35  13.34,57.79 90 top
Q36  13.34,53.98 90 top
Q37  57.47,161.61 90 top
Q38  57.47,158.12 90 top
Q39  57.47,153.99 90 top
Q40  57.47,150.18 90 top
Q41  57.47,146.37 90 top
Q42  57.47,142.56 90 top
Q43  57.47,138.75 90 top
Q44  57.47,79.69 90 top
Q45  57.47,75.88 90 top
Q46  57.47,72.07 90 top
Q47  57.47,68.26 90 top
Q48  57.47,64.45 90 top
Q49  57.47,60.64 90 top
Q50  57.47,56.83 90 top
Q51  13.34,34.93 90 top
Q52  13.34,31.12 90 top
Q53  13.34,27.31 90 top
Q54  13.34,23.5 90 top
Q55  13.34,19.69 90 top
Q56  13.34,15.88 90 top
Q57  13.34,12.06 90 top
Q66  13.34,203.2 90 top
Q67  13.34,199.39 90 top
Q68  13.34,195.58 90 top
Q69  13.34,191.77 90 top
Q70  13.34,187.96 90 top
Q71  13.34,184.15 90 top
Q72  13.34,180.34 90 top
R1  23.81,118.75 0 top
R2  18.73,120.65 0 top
R3  23.81,114.94 0 top
R4  18.73,116.84 0 top
R5  23.81,111.44 0 top
R6  18.73,113.03 0 top
R7  23.81,107.31 0 top
R8  18.73,109.22 0 top
R9  23.81,103.5 0 top
R10  18.73,105.41 0 top
R11  23.81,99.7 0 top
R12  18.73,101.6 0 top
R13  23.81,95.89 0 top
R14  18.73,97.79 0 top
R15  67.94,202.25 0 top
R16  62.87,204.47 0 top
R17  67.94,198.44 0 top
R18  62.87,200.66 0 top
R19  67.94,194.63 0 top
R20  62.87,196.85 0 top
R21  67.94,190.82 0 top
R22  62.87,193.04 0 top
R23  67.94,187.01 0 top
R24  62.87,189.23 0 top
R25  67.94,183.2 0 top
R26  62.87,185.42 0 top
R27  67.94,179.39 0 top
R28  62.87,181.61 0 top
R29  67.94,122.24 0 top
R30  62.87,124.14 0 top
R31  67.94,118.43 0 top
R32  62.87,120.33 0 top
R33  67.94,114.62 0 top
R34  62.87,116.52 0 top
R35  67.94,110.81 0 top
R36  62.87,112.71 0 top
R37  67.94,107 0 top
R38  62.87,108.9 0 top
R39  67.94,102.87 0 top
R40  62.87,104.78 0 top
R41  67.94,99.38 0 top
R42  62.87,101.28 0 top
R43  23.81,160.66 0 top
R44  18.73,162.56 0 top
R45  23.81,156.84 0 top
R46  18.73,158.75 0 top
R47  23.81,153.03 0 top
R48  18.73,154.94 0 top
R49  23.81,149.22 0 top
R50  18.73,151.13 0 top
R51  23.81,145.42 0 top
R52  18.73,147.32 0 top
R53  23.81,141.61 0 top
R54  18.73,143.51 0 top
R55  23.81,137.8 0 top
R56  18.73,139.7 0 top
R57  23.81,75.88 0 top
R58  18.73,77.79 0 top
R59  23.81,72.07 0 top
R60  18.73,73.98 0 top
R61  23.81,68.26 0 top
R62  18.73,70.17 0 top
R63  23.81,64.45 0 top
R64  18.73,66.36 0 top
R65  23.81,60.64 0 top
R66  18.73,62.55 0 top
R67  23.81,56.83 0 top
R68  18.73,58.74 0 top
R69  23.81,53.02 0 top
R70  18.73,54.93 0 top
R71  67.94,160.66 0 top
R72  122.56,101.28 0 top
R73  67.94,157.16 0 top
R74  62.87,159.07 0 top
R75  67.94,153.03 0 top
R76  62.87,154.94 0 top
R77  67.94,149.22 0 top
R78  62.87,151.13 0 top
R79  67.94,145.42 0 top
R80  62.87,147.32 0 top
R81  67.94,141.61 0 top
R82  62.87,143.51 0 top
R83  67.94,137.8 0 top
R84  62.87,139.7 0 top
R85  67.94,78.74 0 top
R86  62.87,80.65 0 top
R87  67.94,74.61 0 top
R88  62.87,76.84 0 top
R89  67.94,70.8 0 top
R90  62.87,73.03 0 top
R91  67.94,67.31 0 top
R92  62.87,69.22 0 top
R93  67.94,63.5 0 top
R94  62.87,65.41 0 top
R95  67.94,59.69 0 top
R96  62.87,61.59 0 top
R97  67.94,55.88 0 top
R98  62.87,57.79 0 top
R99  23.81,33.97 0 top
R100  18.73,35.88 0 top
R101  23.81,30.48 0 top
R102  18.73,32.39 0 top
R103  23.81,26.35 0 top
R104  18.73,28.26 0 top
R105  23.81,22.54 0 top
R106  18.73,24.45 0 top
R107  23.81,18.73 0 top
R108  18.73,20.64 0 top
R109  23.81,14.92 0 top
R110  18.73,16.83 0 top
R111  23.81,11.11 0 top
R112  18.73,13.02 0 top
R129  23.81,202.25 0 top
R130  94.93,160.02 180 top
R131  19.05,204.15 0 top
R132  23.81,198.44 0 top
R133  19.05,200.34 0 top
R134  23.81,194.63 0 top
R135  19.05,196.53 0 top
R136  23.81,191.13 0 top
R137  19.05,192.72 0 top
R138  23.81,187.01 0 top
R139  19.05,188.91 0 top
R140  23.81,183.2 0 top
R141  19.05,185.1 0 top
R142  23.81,179.7 0 top
R143  19.05,181.29 0 top
SV1  9.65,192.91 90 top
SW1  116.84,155.57 180 top
U1  100.81,149.6 315 top
U$8  121.92,167.32 0 top
U$9  121.92,189.23 0 top
X1  117.47,207.64 180 top
X2  95.25,207.64 180 top
X3  -4.06,-23.75 0 top  (outside the outline)
X4  6.35,192.41 90 top
X-D1G  49.53,189.87 270 top
X-D2  5.4,148.27 270 top
X-D2GNEW  49.53,148.27 270 top
X-D3  5.4,106.68 270 top
X-D3G  49.53,106.68 270 top
X-D4  5.4,65.09 270 top
X-D4G  49.53,65.09 270 top
X-DOT  5.4,23.5 270 top
Y1  100.97,141.61 270 top

### Tracks (layer width: path | path; a pad name or v marks a point on that pad's centre or on a via)
+5V  (18 unrouted)
+7V  (1 unrouted)
AREF  (1 unrouted)
B_OUT$1
  Top 0.254: R129.2 24.77,200.66 25.08,200.34 29.84,200.34 37.15,193.04 IC2.15
B_OUT$2
  Top 0.254: IC2.1 30.16,194.31 27.94,196.53 25.72,196.53 24.77,197.49 R132.2
B_OUT$3
  Top 0.254: IC2.2 30.48,193.04 27.62,195.9 25.08,195.9 24.77,195.58 R134.2
B_OUT$4
  Top 0.254: IC2.3 24.77,191.77 R136.2
B_OUT$5
  Top 0.254: IC2.4 30.16,190.5 28.89,189.23 25.08,189.23 24.77,188.91 R138.2
B_OUT$6
  Top 0.254: IC2.5 30.8,189.23 26.67,185.1 25.08,185.1 24.77,184.78 R140.2
B_OUT$7
  Top 0.254: IC2.6 30.48,187.96 26.99,184.47 26.99,183.2 24.77,180.98 R142.2
B_OUT$8  (via drill 0.6)
  Top 0.254: v35.88,191.77 35.88,187.64 34.92,186.69 IC2.7 | v35.88,195.58 35.88,200.03 46.67,210.82 66.67,210.82 68.9,208.6 R15.2
  Bottom 0.254: v35.88,191.77 v35.88,195.58
B_OUT$9  (1 unrouted)
B_OUT$10  (1 unrouted)
B_OUT$11  (1 unrouted)
B_OUT$12  (1 unrouted)
B_OUT$13  (1 unrouted)
B_OUT$14  (1 unrouted)
B_OUT$15  (1 unrouted)
B_OUT$16  (1 unrouted)
B_OUT$17  (1 unrouted)
B_OUT$18  (1 unrouted)
B_OUT$19  (1 unrouted)
B_OUT$20  (1 unrouted)
B_OUT$21  (1 unrouted)
B_OUT$22  (1 unrouted)
B_OUT$23  (1 unrouted)
B_OUT$24  (1 unrouted)
B_OUT$25  (1 unrouted)
B_OUT$26  (1 unrouted)
B_OUT$27  (1 unrouted)
B_OUT$28  (1 unrouted)
B_OUT$29  (1 unrouted)
B_OUT$30  (1 unrouted)
B_OUT$31  (1 unrouted)
B_OUT$32  (1 unrouted)
B_OUT$33  (1 unrouted)
B_OUT$34  (1 unrouted)
B_OUT$35  (1 unrouted)
B_OUT$36  (1 unrouted)
B_OUT$37  (1 unrouted)
B_OUT$38  (1 unrouted)
B_OUT$39  (1 unrouted)
B_OUT$40  (1 unrouted)
B_OUT$41  (1 unrouted)
B_OUT$42  (1 unrouted)
B_OUT$43  (1 unrouted)
B_OUT$44  (1 unrouted)
B_OUT$45  (1 unrouted)
B_OUT$46  (1 unrouted)
B_OUT$47  (1 unrouted)
B_OUT$48  (1 unrouted)
B_OUT$49  (1 unrouted)
B_OUT$50  (1 unrouted)
B_OUT$51  (1 unrouted)
B_OUT$52  (1 unrouted)
B_OUT$53  (1 unrouted)
B_OUT$54  (1 unrouted)
B_OUT$55  (1 unrouted)
B_OUT$56  (1 unrouted)
B_OUT$57  (1 unrouted)
B_OUT$58  (1 unrouted)
B_OUT$59  (1 unrouted)
B_OUT$60  (1 unrouted)
B_OUT$61  (1 unrouted)
B_OUT$62  (1 unrouted)
B_OUT$63  (1 unrouted)
CLOCK  (8 unrouted)
COM  (17 unrouted)
D11/MOSI  (1 unrouted)
D12/MISO  (1 unrouted)
D13/SCK  (1 unrouted)
GND  (via drill 0.6)  (87 unrouted)
  Top 0.254: IC2.13 36.83,190.5 36.51,190.18 36.51,187.32 34.61,185.42 IC2.8 31.24,185.42 27.46,181.64 27.37,181.58 v26.57,181.58 26.51,181.48 26.51,179.2 24,176.69 23.94,176.59 5.46,176.59 | R143.2 20.45,181.48 23.11,181.48 23.21,181.55 v23.24,181.58 | v23.11,185.29 20.83,185.29 20.57,185.55 20.32,185.29 R141.2 | v23.11,204.34 20.83,204.34 20.57,204.6 20.32,204.34 R131.2 | v23.11,200.53 20.83,200.53 20.57,200.79 20.32,200.53 R133.2 | v23.11,196.47 20.83,196.47 20.57,196.22 20.32,196.47 R135.2 | v23.11,192.91 20.83,192.91 20.57,193.17 20.32,192.91 R137.2 | v23.11,188.85 20.83,188.85 20.57,188.59 20.32,188.85 R139.2
  Bottom 0.254: v26.57,181.58 v23.24,181.58 23.11,181.74 v23.11,185.29 v23.11,188.85 v23.11,192.91 v23.11,196.47 v23.11,200.53 v23.11,204.34
LATCH  (8 unrouted)
N$1  (1 unrouted)
N$2  (1 unrouted)
N$4  (1 unrouted)
N$7  (1 unrouted)
N$9  (1 unrouted)
N$10  (1 unrouted)
N$11  (1 unrouted)
N$12  (1 unrouted)
N$13  (1 unrouted)
N$14  (1 unrouted)
N$15  (1 unrouted)
N$16  (1 unrouted)
N$17  (1 unrouted)
N$18  (1 unrouted)
N$19  (1 unrouted)
N$20  (1 unrouted)
N$21  (1 unrouted)
N$22  (1 unrouted)
N$23  (1 unrouted)
N$26  (1 unrouted)
N$27  (1 unrouted)
N$28  (1 unrouted)
N$29  (1 unrouted)
N$30  (1 unrouted)
N$31  (1 unrouted)
N$32  (1 unrouted)
N$33  (1 unrouted)
N$34  (1 unrouted)
N$35  (1 unrouted)
N$37  (1 unrouted)
N$38  (1 unrouted)
N$39  (1 unrouted)
N$40  (1 unrouted)
N$41  (1 unrouted)
N$42  (1 unrouted)
N$43  (1 unrouted)
N$45  (1 unrouted)
N$46  (1 unrouted)
N$48  (1 unrouted)
N$49  (1 unrouted)
N$51  (1 unrouted)
N$52  (1 unrouted)
N$54  (1 unrouted)
N$55  (1 unrouted)
N$57  (1 unrouted)
N$58  (1 unrouted)
N$60  (1 unrouted)
N$61  (1 unrouted)
N$62  (1 unrouted)
N$63  (1 unrouted)
N$64  (1 unrouted)
N$65  (1 unrouted)
N$66  (1 unrouted)
N$67  (1 unrouted)
N$68  (1 unrouted)
N$70  (1 unrouted)
N$71  (1 unrouted)
N$73  (1 unrouted)
N$74  (1 unrouted)
N$76  (1 unrouted)
N$77  (1 unrouted)
N$79  (1 unrouted)
N$80  (1 unrouted)
N$82  (1 unrouted)
N$83  (1 unrouted)
N$85  (1 unrouted)
N$86  (1 unrouted)
N$88  (1 unrouted)
N$89  (1 unrouted)
N$90  (1 unrouted)
N$91  (1 unrouted)
N$92  (1 unrouted)
N$93  (1 unrouted)
N$94  (1 unrouted)
N$95
  Top 0.254: R44.1 17.27,162.69 16.76,162.69 16.51,162.43 14.48,162.43 Q23.2
N$96
  Top 0.254: R43.1 14.48,160.66 Q23.1
N$98
  Top 0.254: R46.1 17.27,158.88 16.76,158.88 16.51,158.62 14.48,158.62 Q24.2
N$99
  Top 0.254: Q24.1 14.48,156.84 22.61,156.84 22.86,157.1 23.11,156.84 R45.1
N$101
  Top 0.254: R48.1 17.27,155.07 16.76,155.07 16.51,154.81 14.48,154.81 Q25.2
N$102
  Top 0.254: R47.1 14.48,153.03 Q25.1
N$104
  Top 0.254: R50.1 17.27,151.26 16.76,151.26 16.51,151 14.48,151 Q26.2
N$105
  Top 0.254: R49.1 14.48,149.22 Q26.1
N$107
  Top 0.254: R52.1 17.27,147.45 16.76,147.45 16.51,147.19 14.48,147.19 Q27.2
N$108
  Top 0.254: Q27.1 14.48,145.42 22.61,145.42 22.86,145.67 23.11,145.42 R51.1
N$110
  Top 0.254: Q28.2 14.48,143.38 17.02,143.38 17.27,143.13 17.53,143.38 R54.1
N$111
  Top 0.254: R53.1 14.48,141.61 Q28.1
N$113
  Top 0.254: R56.1 17.27,139.83 16.76,139.83 16.51,139.57 14.48,139.57 Q29.2
N$114
  Top 0.254: R55.1 22.86,137.29 17.02,137.29 16.51,137.8 14.48,137.8 Q29.1
N$116
  Top 0.254: X-D2.7 5.59,138.81 12.19,138.81 Q29.3
N$117
  Top 0.254: X-D2.6 5.59,142.62 12.19,142.62 Q28.3
N$118
  Top 0.254: X-D2.5 5.59,146.43 12.19,146.43 Q27.3
N$119
  Top 0.254: X-D2.4 5.59,150.24 12.19,150.24 Q26.3
N$120
  Top 0.254: X-D2.3 5.59,154.05 12.19,154.05 Q25.3
N$121
  Top 0.254: X-D2.2 5.59,157.86 12.19,157.86 Q24.3
N$122
  Top 0.254: Q23.3 12.19,161.67 5.59,161.67 X-D2.1
N$123  (1 unrouted)
N$124  (1 unrouted)
N$126  (1 unrouted)
N$127  (1 unrouted)
N$129  (1 unrouted)
N$130  (1 unrouted)
N$132  (1 unrouted)
N$133  (1 unrouted)
N$135  (1 unrouted)
N$136  (1 unrouted)
N$138  (1 unrouted)
N$139  (1 unrouted)
N$141  (1 unrouted)
N$142  (1 unrouted)
N$144  (1 unrouted)
N$145  (1 unrouted)
N$146  (1 unrouted)
N$147  (1 unrouted)
N$148  (1 unrouted)
N$149  (1 unrouted)
N$150  (1 unrouted)
N$151  (1 unrouted)
N$152  (1 unrouted)
N$154  (1 unrouted)
N$155  (1 unrouted)
N$157  (1 unrouted)
N$158  (1 unrouted)
N$160  (1 unrouted)
N$161  (1 unrouted)
N$163  (1 unrouted)
N$164  (1 unrouted)
N$166  (1 unrouted)
N$167  (1 unrouted)
N$169  (1 unrouted)
N$170  (1 unrouted)
N$172  (1 unrouted)
N$173  (1 unrouted)
N$174  (1 unrouted)
N$175  (1 unrouted)
N$176  (1 unrouted)
N$177  (1 unrouted)
N$178  (1 unrouted)
N$179  (1 unrouted)
N$180  (1 unrouted)
N$182  (1 unrouted)
N$183  (1 unrouted)
N$185  (1 unrouted)
N$186  (1 unrouted)
N$188  (1 unrouted)
N$189  (1 unrouted)
N$191  (1 unrouted)
N$192  (1 unrouted)
N$194  (1 unrouted)
N$195  (1 unrouted)
N$197  (1 unrouted)
N$198  (1 unrouted)
N$200  (1 unrouted)
N$201  (1 unrouted)
N$202  (1 unrouted)
N$203
  Top 0.254: R135.1 14.61,196.53 Q68.2
N$204
  Top 0.254: R131.1 14.61,204.15 Q66.2
N$205
  Top 0.254: Q66.1 14.35,202.25 22.83,202.25 22.86,202.28 22.89,202.25 R129.1
N$207
  Top 0.254: R134.1 22.86,194.69 14.48,194.69 Q68.1
N$208
  Top 0.254: R133.1 14.61,200.34 Q67.2
N$209
  Top 0.254: R132.1 22.86,198.5 14.48,198.5 Q67.1
N$212
  Top 0.254: R137.1 14.61,192.72 Q69.2
N$213
  Top 0.254: Q69.1 14.48,190.88 22.86,190.88 23.11,191.13 R136.1
N$215
  Top 0.254: R139.1 14.61,188.91 Q70.2
N$216
  Top 0.254: R138.1 22.86,187.07 14.48,187.07 Q70.1
N$218
  Top 0.254: R141.1 14.61,185.1 Q71.2
N$219
  Top 0.254: R140.1 22.86,183.26 14.48,183.26 Q71.1
N$221
  Top 0.254: R143.1 14.61,181.29 Q72.2
N$222
  Top 0.254: R142.1 22.86,179.23 15.27,179.23 15.11,179.39 14.35,179.39 Q72.1
N$224  (1 unrouted)
N$225  (1 unrouted)
N$226  (1 unrouted)
  Top 0.254: 12.06,187.96 Q70.3
N$227  (1 unrouted)
N$228  (1 unrouted)
N$229  (1 unrouted)
N$230  (1 unrouted)
N$231  (1 unrouted)
N$232  (1 unrouted)
N$233  (1 unrouted)
N$234  (1 unrouted)
N$235  (1 unrouted)
N$236  (1 unrouted)
N$238  (1 unrouted)
N$239  (1 unrouted)
N$241  (1 unrouted)
N$242  (1 unrouted)
N$244  (1 unrouted)
N$245  (1 unrouted)
N$247  (1 unrouted)
N$248  (1 unrouted)
N$250  (1 unrouted)
N$251  (1 unrouted)
N$253  (1 unrouted)
N$254  (1 unrouted)
N$256  (1 unrouted)
N$257  (1 unrouted)
N$258  (1 unrouted)
N$259  (1 unrouted)
N$260  (1 unrouted)
N$261  (1 unrouted)
N$262  (1 unrouted)
RESET  (2 unrouted)
VUSB  (3 unrouted)
X-D1G  (1 unrouted)
(copper drawn outside any net)
  shapes: Top area x2